# Altium schematic sheet USB_to_CAN.SchDoc
size 381 x 241 mm
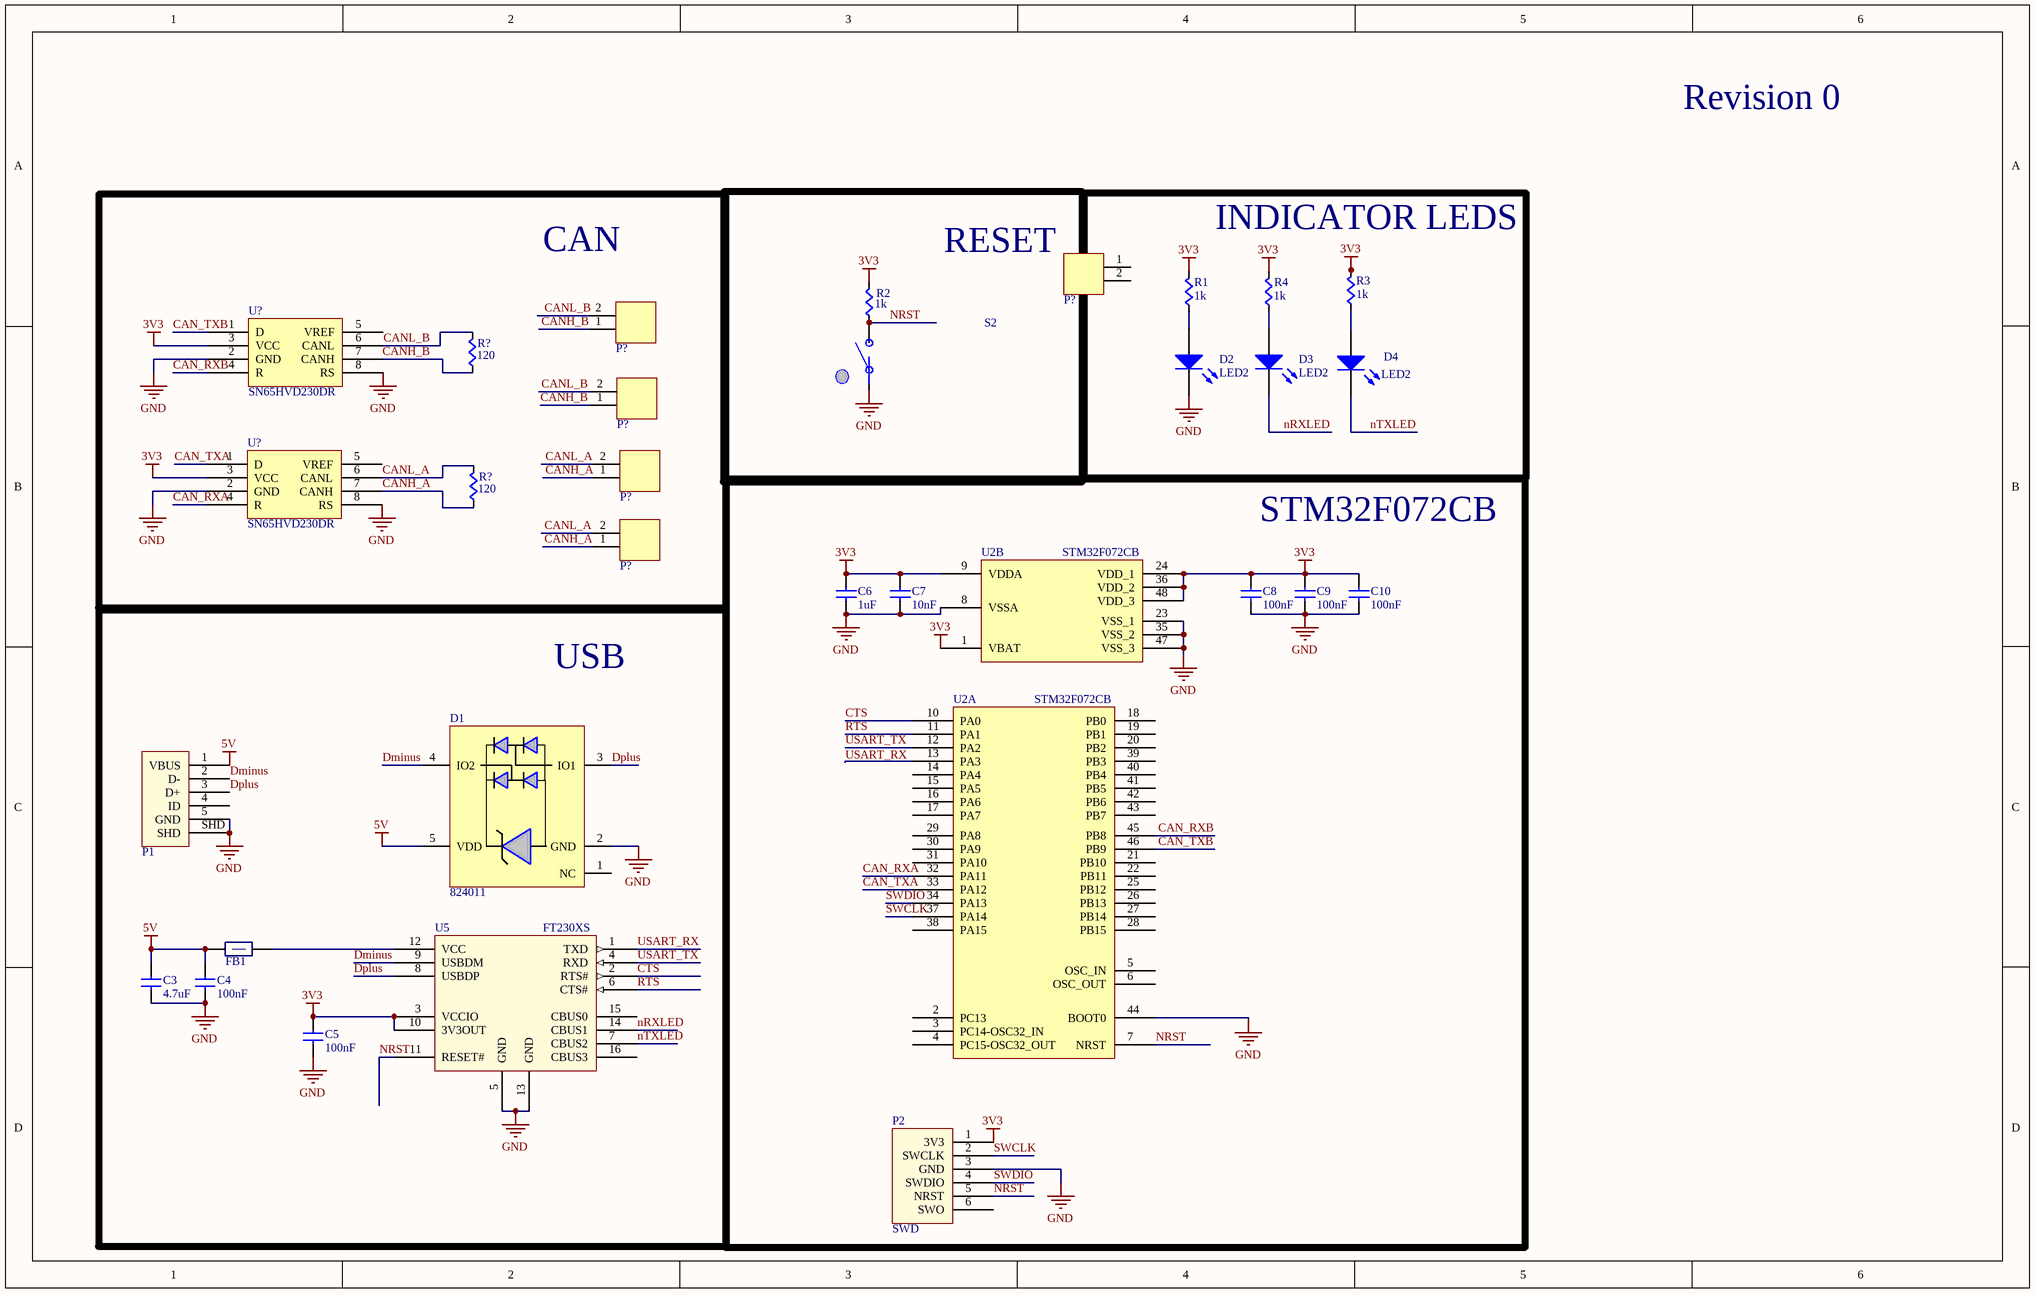
[diagram p0: USB_to_CAN.SchDoc]

## Parts
(Parts that share a designator on the sheet are numbered #1, #2 ... from top to bottom, then left to right.)
C3  value 4.7uF  [CAPC0603]  (hidden comment: Cap)
C4  value 100nF  [CAPC0603]  (hidden comment: Cap)
C5  value 100nF  [CAPC0603]  (hidden comment: Cap)
C6  value 1uF  [CAPC0603]  (hidden comment: Cap)
C7  value 10nF  [CAPC0603]  (hidden comment: Cap)
C8  value 100nF  [CAPC0603]  (hidden comment: Cap)
C9  value 100nF  [CAPC0603]  (hidden comment: Cap)
C10  value 100nF  [CAPC0603]  (hidden comment: Cap)
D1  824011  [SOT95P280X116-5N]
D2  LED2  [3.2X1.6X1.1]
D3  LED2  [3.2X1.6X1.1]
D4  LED2  [3.2X1.6X1.1]
FB1  FBead  [RES0603]  (value not drawn)
P1  UX60SC-MB-5ST  [UX60SC-MB-5ST]  (value not drawn)
P2  SWD  [SWD_STM32]
P?#1  2-pin Horz Sherlock  [MOLEX-HDR-1X2-SHERLOCK-HORZ]  (value not drawn)
P?#2  2-pin Horz Sherlock  [MOLEX-HDR-1X2-SHERLOCK-HORZ]  (value not drawn)
P?#3  2-pin Horz Sherlock  [MOLEX-HDR-1X2-SHERLOCK-HORZ]  (value not drawn)
P?#4  2-pin Horz Sherlock  [MOLEX-HDR-1X2-SHERLOCK-HORZ]  (value not drawn)
P?#5  2-pin Horz Sherlock  [MOLEX-HDR-1X2-SHERLOCK-HORZ]  (value not drawn)
R1  value 1k  [RES0603]  (hidden comment: Res)
R2  value 1k  [RES0603]  (hidden comment: Res)
R3  value 1k  [RES0603]  (hidden comment: Res)
R4  value 1k  [RES0603]  (hidden comment: Res)
R?#1  value 120  [RES0603]  (hidden comment: Res)
R?#2  value 120  [RES0603]  (hidden comment: Res)
S2  Button  [PTS645xxxxSMTR92]  (value not drawn)
U2  STM32F072CB  [STM32F072CB]  (parts A,B of 2)
U5  FT230XS  [FT230XS]
U?#1  SN65HVD230DR  [SOIC-8pin]
U?#2  SN65HVD230DR  [SOIC-8pin]

## Blocks framed on the sheet
CAN: P?#2-P?#5 R?#1 R?#2 U?#1 U?#2
RESET: R2 S2
INDICATOR LEDS: D2-D4 P?#1 R1 R3 R4
STM32F072CB: C6-C10 P2 U2
USB: C3-C5 D1 FB1 P1 U5

## Nets
3V3: C5.1(A) C6.1(A) C7.1(A) C8.1(A) C9.1(A) C10.1(A) P2.1(3V3) R1.1(A) R2.1(A) R3.1(A) R4.1(A) U2.1(VBAT) U2.9(VDDA) U2.24(VDD_1) U2.36(VDD_2) U2.48(VDD_3) U5.3(VCCIO) U5.10(3V3OUT) U?#1.3(VCC) U?#2.3(VCC)
5V: C3.1(A) C4.1(A) D1.5(VDD) FB1.1(A) P1.1(VBUS)
GND: C3.2(B) C4.2(B) C5.2(B) C6.2(B) C7.2(B) C8.2(B) C9.2(B) C10.2(B) D1.2(GND) D2.2(K) P1.5(GND) P1.SHD P2.3(GND) S2.A U2.8(VSSA) U2.23(VSS_1) U2.35(VSS_2) U2.44(BOOT0) U2.47(VSS_3) U5.5(GND) U5.13(GND) U?#1.2(GND) U?#1.8(RS) U?#2.2(GND) U?#2.8(RS)
CAN_RXA: U2.32(PA11) U?#2.4(R)
CAN_RXB: U2.45(PB8) U?#1.4(R)
CAN_TXA: U2.33(PA12) U?#2.1(D)
CAN_TXB: U2.46(PB9) U?#1.1(D)
CANH_A: P?#4.1 P?#5.1 R?#2.2(B) U?#2.7(CANH)
CANH_B: P?#2.1 P?#3.1
CANL_A: P?#4.2 P?#5.2 R?#2.1(A) U?#2.6(CANL)
CANL_B: P?#2.2 P?#3.2 R?#1.1(A) U?#1.6(CANL)
CTS: U2.10(PA0) U5.2(RTS#)
Dminus: D1.4(IO2) P1.2(D-) U5.9(USBDM)
Dplus: D1.3(IO1) P1.3(D+) U5.8(USBDP)
NRST: P2.5(NRST) R2.2(B) S2.B U2.7(NRST) U5.11(RESET#)
nRXLED: D3.2(K) U5.14(CBUS1)
nTXLED: D4.2(K) U5.7(CBUS2)
RTS: U2.11(PA1) U5.6(CTS#)
SWCLK: P2.2(SWCLK) U2.37(PA14)
SWDIO: P2.4(SWDIO) U2.34(PA13)
USART_RX: U2.13(PA3) U5.1(TXD)
USART_TX: U2.12(PA2) U5.4(RXD)
NetD2_1: D2.1(A) R1.2(B)
NetD3_1: D3.1(A) R4.2(B)
NetD4_1: D4.1(A) R3.2(B)
NetFB1_2: FB1.2(B) U5.12(VCC)
NetR?#1_2: R?#1.2(B) U?#1.7(CANH)

Not connected (* = marked no-connect by the designer): D1 1(NC); P1 4(ID); P2 6(SWO); P?#1 1 2; U2 2(PC13) 3(PC14-OSC32_IN) 4(PC15-OSC32_OUT) 5(OSC_IN) 6(OSC_OUT) 14(PA4) 15(PA5) 16(PA6) 17(PA7) 18(PB0) 19(PB1) 20(PB2) 21(PB10) 22(PB11) 25(PB12) 26(PB13) 27(PB14) 28(PB15) 29(PA8) 30(PA9) 31(PA10) 38(PA15) 39(PB3) 40(PB4) 41(PB5) 42(PB6) 43(PB7); U5 15(CBUS0) 16(CBUS3); U?#1 5(VREF); U?#2 5(VREF)

## Notes on the sheet
- Revision 0
- Labels drawn without touching a wire or pin: CANH_B

## Library data of the parts
D1 = 824011: USB ESD Protection Diodes
D2-D4 = LED2: Typical RED, GREEN, YELLOW, AMBER GaAs LED; Published: 8-Jun-2000; LatestRevisionDate: 17-Jul-2002; LatestRevisionNote: Re-released for DXP Platform.; PackageVersion: Feb-2002; PackageReference: 3.2X1.6X1.1; Publisher: Altium Limited; PackageDescription: SM LED; 2 Flat Leads
FB1 = FBead: Ferrite Bead; Supplier 1: Digi-Key; Supplier Part Number 1: 445-2988-1-ND
P1 = UX60SC-MB-5ST: USB Mini B Metal Shield SMT; Supplier 1: Digi-Key; Supplier Part Number 1: H11671CT-ND
P2 = SWD_STM32: SWD connector matching the pinout on STM Discovery Boards
P?#1-P?#5 = MOLEX-HDR-1x2-SHERLOCK_RA: Header, Molex, 2mm Pitch Sherlock Header, Single Row, Horizontal, 2 Circuits, Length 3.3mm,  0353630260; Manufacturer: Molex Inc; Manufacturer Part Number: 0353630260; Supplier Part Number 1: WM18931-ND; Supplier 1: Digi-Key
S2 = Button: SPST Button; Supplier 1: Digi-Key; Supplier Part Number 1: CKN9087CT-ND
U2 = STM32F072CB: MCU 32BIT 128KB FLASH 48LQFP; Supplier 1: Digi-Key; Supplier Part Number 1: 497-14645-ND
U5 = FT230XS: USB To Basic UART IC; Supplier 1: Digi-Key; Supplier Part Number 1: 768-1154-5-ND
U?#1 U?#2 = SN65HVD230DR: IC TXRX CAN 1MBPS 3.3V 8SOIC; Supplier 1: Digi-Key; Supplier Part Numbe 1: 296-11654-1-ND
C3-C10 = Cap: Supplier 1: Digi-Key
  C3: Supplier Part Number 1: 311-1455-1-ND
  C4 C5 C8-C10: Supplier Part Number 1: 1276-1000-1-ND
R1-R4 R?#1 R?#2 = Res: Supplier 1: Digi-Key
  R1 R3 R4 R?#1 R?#2: Supplier Part Number 1: RMCF0603JT10K0CT-ND